# EAGLE design Nixiespeed2 (EAGLE 7.6.0)
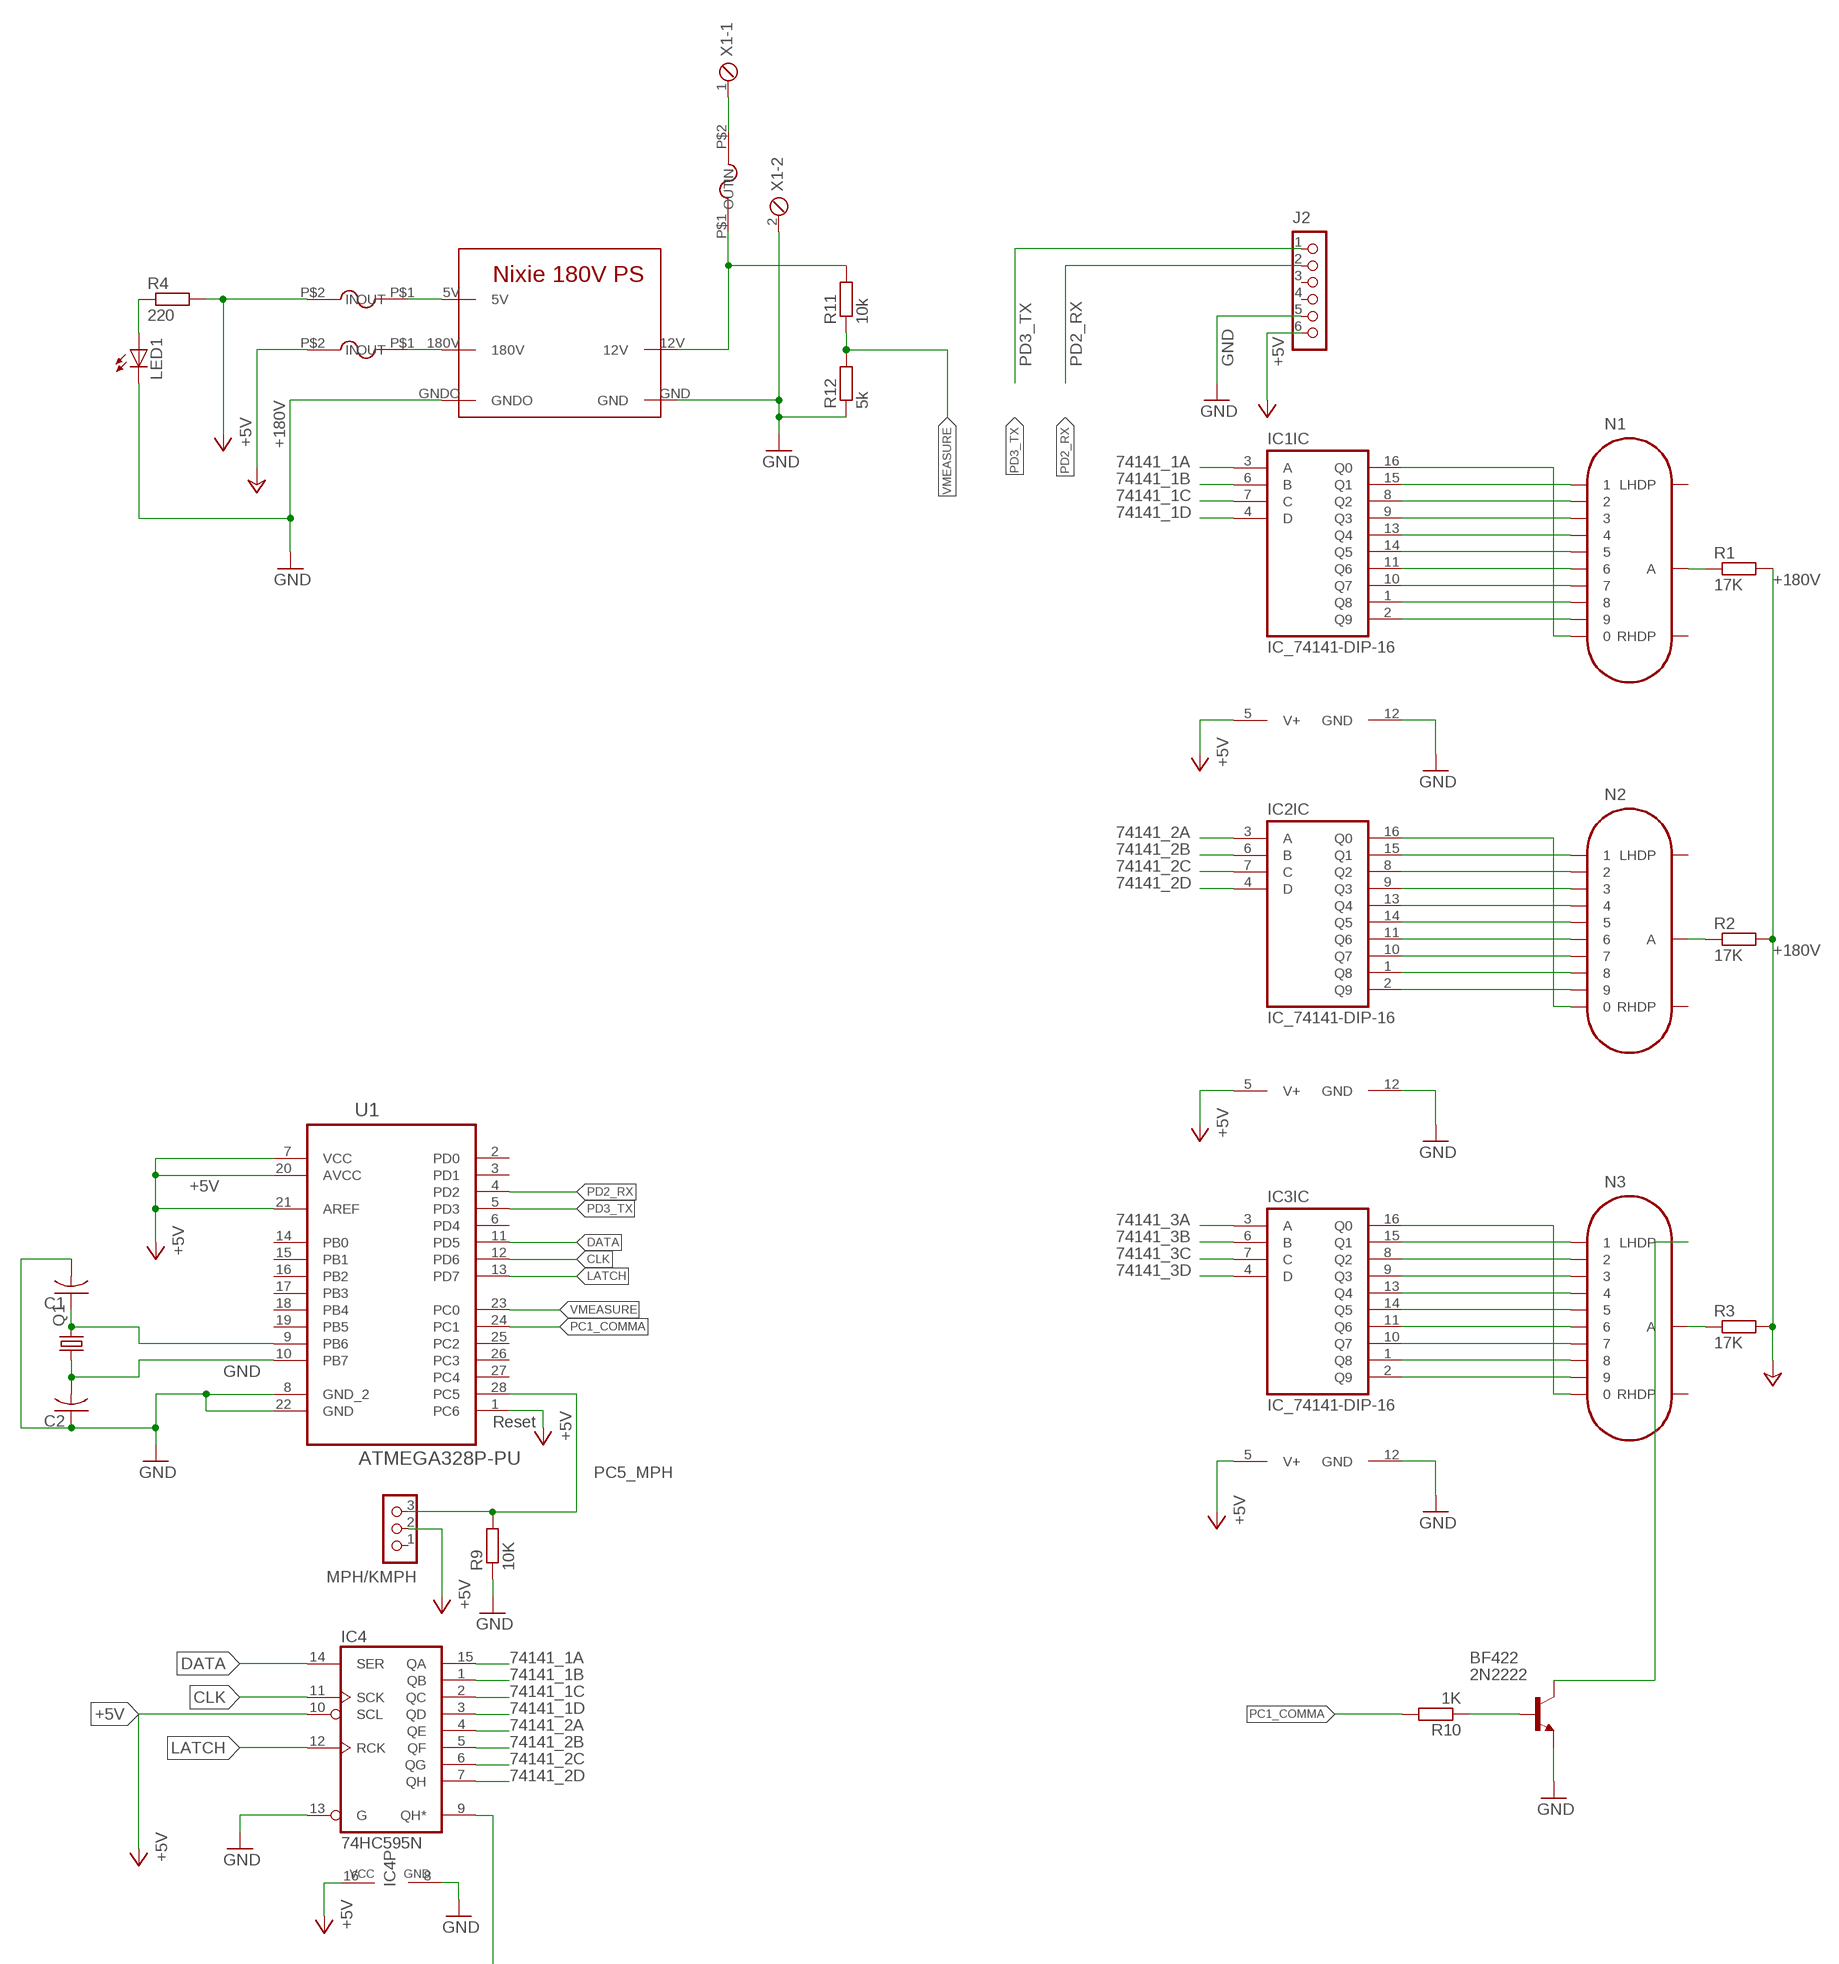
[diagram p0: schematic, sheet 1, part 1 of 2]
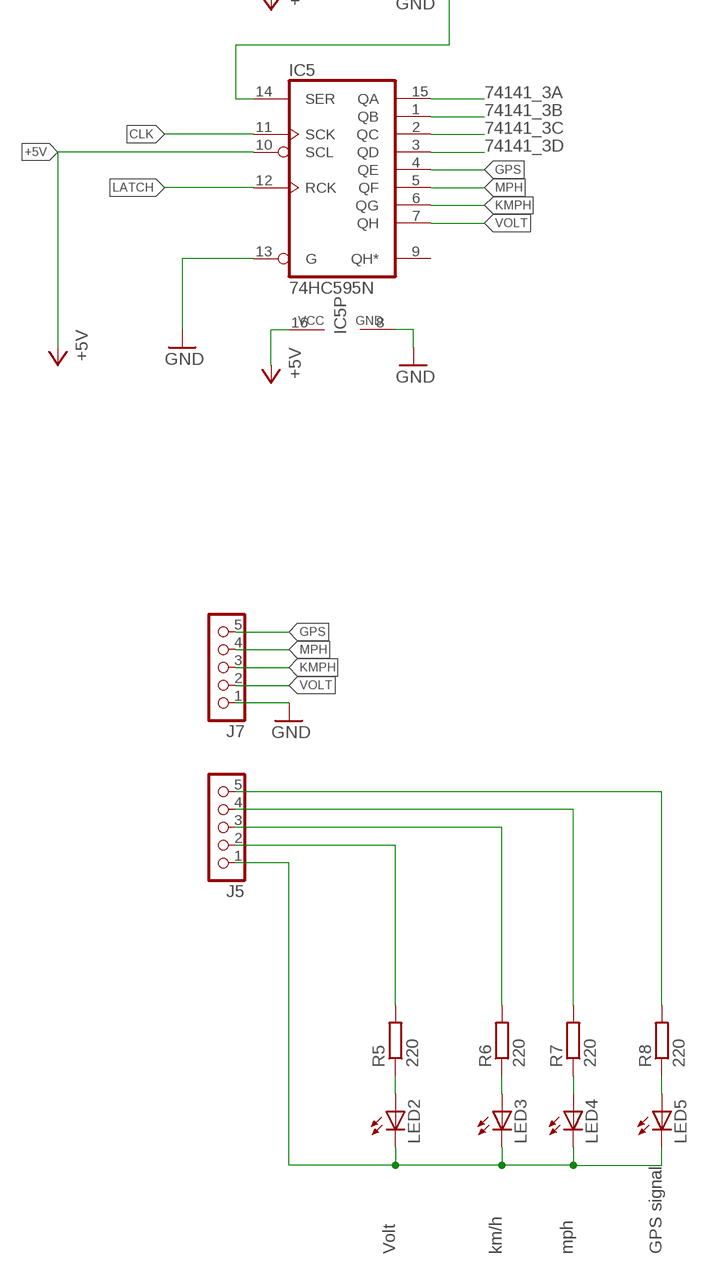
[diagram p1: schematic, sheet 1, part 2 of 2]

## Parts
BF422  2N2222  [TO92-EBC-OVAL]
C1  C-USC1206  [C1206]
C2  C-USC1206  [C1206]
F2  MICROFUSE  [MICROFUSE]
F3  MICROFUSE  [MICROFUSE]
IC1  IC_74141-DIP-16  [DIL16]
IC2  IC_74141-DIP-16  [DIL16]
IC3  IC_74141-DIP-16  [DIL16]
IC4  74HC595N  [DIL16]
IC5  74HC595N  [DIL16]
J2  CON_HEADER_1X06-PTH  [M1X6]
J5  CON_HEADER_1X05-PTH  [M1X5]
J7  CON_HEADER_1X05-PTH  [M1X5]
LED1  LED3MM  [LED3MM]
LED2  LED3MM  [LED3MM]
LED3  LED3MM  [LED3MM]
LED4  LED3MM  [LED3MM]
LED5  LED3MM  [LED3MM]
MPH/KMPH  CON_HEADER_1X03-PTH  [M1X3]
N1  IN-14  [IN-14]
N2  IN-14  [IN-14]
N3  IN-14  [IN-14]
Q1  CRYSTALHC49S  [HC49/S]
R1  17K  R-EU_0204/7  [0204/7]
R2  17K  R-EU_0204/7  [0204/7]
R3  17K  R-EU_0204/7  [0204/7]
R4  220  R-EU_M1206  [M1206]
R5  220  R-EU_M1206  [M1206]
R6  220  R-EU_M1206  [M1206]
R7  220  R-EU_M1206  [M1206]
R8  220  R-EU_M1206  [M1206]
R9  10K  R-EU_M1206  [M1206]
R10  1K  R-EU_M1206  [M1206]
R11  10k  R-EU_M1206  [M1206]
R12  5k  R-EU_M1206  [M1206]
U1  ATMEGA328P-PU  [DIP254P762X457-28]
U$1  NIXIEPS  [NIXIEPS]
U$2  MICROFUSE  [MICROFUSE]
X1  MPT2  [2POL254]

## Nets
12V: R11.2 U$1.12V U$2.P$1(IN)
74141_1A: IC1.3(IC:A) IC4.15(QA)
74141_1B: IC1.6(IC:B) IC4.1(QB)
74141_1C: IC1.7(IC:C) IC4.2(QC)
74141_1D: IC1.4(IC:D) IC4.3(QD)
74141_2A: IC2.3(IC:A) IC4.4(QE)
74141_2B: IC2.6(IC:B) IC4.5(QF)
74141_2C: IC2.7(IC:C) IC4.6(QG)
74141_2D: IC2.4(IC:D) IC4.7(QH)
74141_3A: IC3.3(IC:A) IC5.15(QA)
74141_3B: IC3.6(IC:B) IC5.1(QB)
74141_3C: IC3.7(IC:C) IC5.2(QC)
74141_3D: IC3.4(IC:D) IC5.3(QD)
+5V: F2.P$2(OUT) IC1.5(SUPPLY:V+) IC2.5(SUPPLY:V+) IC3.5(SUPPLY:V+) IC4.10(SCL) IC4.16(VCC) IC5.10(SCL) IC5.16(VCC) J2.6 MPH/KMPH.2 R4.2 U1.1(PC6) U1.7(VCC) U1.20(AVCC) U1.21(AREF)
+180V: F3.P$2(OUT) R1.2 R2.2 R3.2 ; supply symbol labelled +24V
CLK: IC4.11(SCK) IC5.11(SCK) U1.12(PD6)
DATA: IC4.14(SER) U1.11(PD5)
GND: BF422.E C1.2 C2.1 IC1.12(SUPPLY:GND) IC2.12(SUPPLY:GND) IC3.12(SUPPLY:GND) IC4.8(GND) IC4.13(G) IC5.8(GND) IC5.13(G) J2.5 J7.1 LED1.K(C) R9.1 R12.1 U1.8(GND_2) U1.22(GND) U$1.GND U$1.GNDO X1.2
GPS: IC5.4(QE) J7.5
KMPH: IC5.6(QG) J7.3
LATCH: IC4.12(RCK) IC5.12(RCK) U1.13(PD7)
MPH: IC5.5(QF) J7.4
N$2: IC2.15(IC:Q1) N2.1
N$3: IC2.8(IC:Q2) N2.2
N$4: IC2.9(IC:Q3) N2.3
N$5: IC2.13(IC:Q4) N2.4
N$6: IC2.14(IC:Q5) N2.5
N$7: IC2.11(IC:Q6) N2.6
N$8: IC2.10(IC:Q7) N2.7
N$9: IC2.1(IC:Q8) N2.8
N$10: IC2.2(IC:Q9) N2.9
N$11: IC2.16(IC:Q0) N2.0
N$12: IC1.15(IC:Q1) N1.1
N$13: IC1.8(IC:Q2) N1.2
N$14: IC1.9(IC:Q3) N1.3
N$15: IC1.13(IC:Q4) N1.4
N$16: IC1.14(IC:Q5) N1.5
N$17: IC1.11(IC:Q6) N1.6
N$18: IC1.10(IC:Q7) N1.7
N$19: IC1.1(IC:Q8) N1.8
N$20: IC1.2(IC:Q9) N1.9
N$21: IC1.16(IC:Q0) N1.0
N$22: IC3.15(IC:Q1) N3.1
N$23: IC3.8(IC:Q2) N3.2
N$24: IC3.9(IC:Q3) N3.3
N$25: IC3.13(IC:Q4) N3.4
N$26: IC3.14(IC:Q5) N3.5
N$27: IC3.11(IC:Q6) N3.6
N$28: IC3.10(IC:Q7) N3.7
N$29: IC3.1(IC:Q8) N3.8
N$30: IC3.2(IC:Q9) N3.9
N$31: IC3.16(IC:Q0) N3.0
N$32: N3.A R3.1
N$33: N2.A R2.1
N$34: N1.A R1.1
N$35: LED1.A R4.1
N$36: IC4.9(QH*) IC5.14(SER)
N$37: F2.P$1(IN) U$1.5V
N$38: BF422.B R10.1
N$39: BF422.C N3.LHDP
N$40: LED2.A R5.1
N$41: J5.2 R5.2
N$42: J5.3 R6.2
N$43: J5.4 R7.2
N$44: LED4.A R7.1
N$45: LED3.A R6.1
N$46: LED5.A R8.1
N$48: J5.5 R8.2
N$49: J5.1 LED2.K(C) LED3.K(C) LED4.K(C) LED5.K(C)
N$50: U$2.P$2(OUT) X1.1
N$51: C2.2 Q1.1 U1.10(PB7)
N$52: C1.1 Q1.2 U1.9(PB6)
N$53: F3.P$1(IN) U$1.180V
PC1_COMMA: R10.2 U1.24(PC1)
PC5_MPH: MPH/KMPH.3 R9.2 U1.28(PC5)
PD2_RX: J2.2 U1.4(PD2)
PD3_TX: J2.1 U1.5(PD3)
VMEASURE: R11.1 R12.2 U1.23(PC0)
VOLT: IC5.7(QH) J7.2
Unconnected: IC5.9(QH*) J2.3 J2.4 MPH/KMPH.1 N1.LHDP N1.RHDP N2.LHDP N2.RHDP N3.RHDP U1.2(PD0) U1.3(PD1) U1.6(PD4) U1.14(PB0) U1.15(PB1) U1.16(PB2) U1.17(PB3) U1.18(PB4) U1.19(PB5) U1.25(PC2) U1.26(PC3) U1.27(PC4)

## Notes on the sheet
- Reset
- Volt | km/h | mph | GPS signal

## Library data of the parts
BF422 = adafruit:2N2222: NPN TRANSISTOR Big oval pads
C1 C2 = adafruit:C-US: CAPACITOR, American symbol
F2 F3 U$2 = Nixie:MICROFUSE
IC1-IC3 = dp_devices.v6:IC_74141: BCD to decimal decoder
IC4 IC5 = 74xx-eu:74*595: 8-bit SHIFT REGISTER, output latch
J2 = dp_devices.v6:CON_HEADER_1X06
J5 J7 = dp_devices.v6:CON_HEADER_1X05
LED1-LED5 = led:LED: LED OSRAM: - CHIPLED LG R971, LG N971, LY N971, LG Q971, LY Q971, LO R971, LY R971 LH N974, LH R974 LS Q976, LO Q976, LY Q976 LO Q996 - Hyper CHIPLED LW Q18S LB Q993, LB Q99A, LB R99A - SideLED LS A670, LO A670, LY A670, LG A670, LP A670 LB A673, LV A673, LT A673, LW A673 LH A674 LY A675 LS A676, LA A676, LO A676, LY A676, LW A676 LS A679, LY A679, LG A679 - Hyper Micro SIDELED® LS Y876, LA Y876, LO Y876, LY Y876 LT Y87S - SmartLED LW L88C, LW L88S LB L89C, LB L89S, LG L890 LS L89K, LO L89K, LY L89K LS L896, LA L896, LO L896, LY L896 - TOPLED LS T670, LO T670, LY T670, LG T670, LP T670 LSG T670, LSP T670, LSY T670, LOP T670, LYG T670 LG T671, LOG T671, LSG T671 LB T673, LV T673, LT T673, LW T673 LH T674 LS T676, LA T676, LO T676, LY T676, LB T676, LH T676, LSB T676, LW T676 LB T67C, LV T67C, LT T67C, LS T67K, LO T67K, LY T67K, LW E67C LS E67B, LA E67B, LO E67B, LY E67B, LB E67C, LV E67C, LT E67C LW T67C LS T679, LY T679, LG T679 LS T770, LO T770, LY T770, LG T770, LP T770 LB T773, LV T773, LT T773, LW T773 LH T774 LS E675, LA E675, LY E675, LS T675 LS T776, LA T776, LO T776, LY T776, LB T776 LHGB T686 LT T68C, LB T68C - Hyper Mini TOPLED® LB M676 - Mini TOPLED Santana® LG M470 LS M47K, LO M47K, LY M47K Source: http://www.osram.convergy.de LUXEON: - LUMILED® LXK2-PW12-R00, LXK2-PW12-S00, LXK2-PW14-U00, LXK2-PW14-V00 LXK2-PM12-R00, LXK2-PM12-S00, LXK2-PM14-U00 LXK2-PE12-Q00, LXK2-PE12-R00, LXK2-PE12-S00, LXK2-PE14-T00, LXK2-PE14-U00 LXK2-PB12-K00, LXK2-PB12-L00, LXK2-PB12-M00, LXK2-PB14-N00, LXK2-PB14-P00, LXK2-PB14-Q00 LXK2-PR12-L00, LXK2-PR12-M00, LXK2-PR14-Q00, LXK2-PR14-R00 LXK2-PD12-Q00, LXK2-PD12-R00, LXK2-PD12-S00 LXK2-PH12-R00, LXK2-PH12-S00 LXK2-PL12-P00, LXK2-PL12-Q00, LXK2-PL12-R00 Source: www.luxeon.com KINGBRIGHT: KA-3528ASYC Source: www.kingbright.com
MPH/KMPH = dp_devices.v6:CON_HEADER_1X03
N1-N3 = russian-nixies:IN-14: IN-14: medium numeric frontview nixie tube
Q1 = adafruit:CRYSTAL: CRYSTAL; OC_FARNELL: 1667008; OC_NEWARK: unknown
R1-R12 = resistor:R-EU_: RESISTOR, European symbol
U1 = Atmel_By_element14_Batch_1-00:ATMEGA328P-PU: 8-bit Microcontroller with In-System Programmable Flash; MPN: ATMEGA328P-PU; OC_FARNELL: 1715487; OC_NEWARK: 15R0268; PACKAGE: PDIP-28; SUPPLIER: Atmel
U$1 = Nixie:NIXIEPS
X1 = con-phoenix-254:MPT2: PHOENIX CONNECTOR; OC_FARNELL: unknown; OC_NEWARK: unknown

## Board
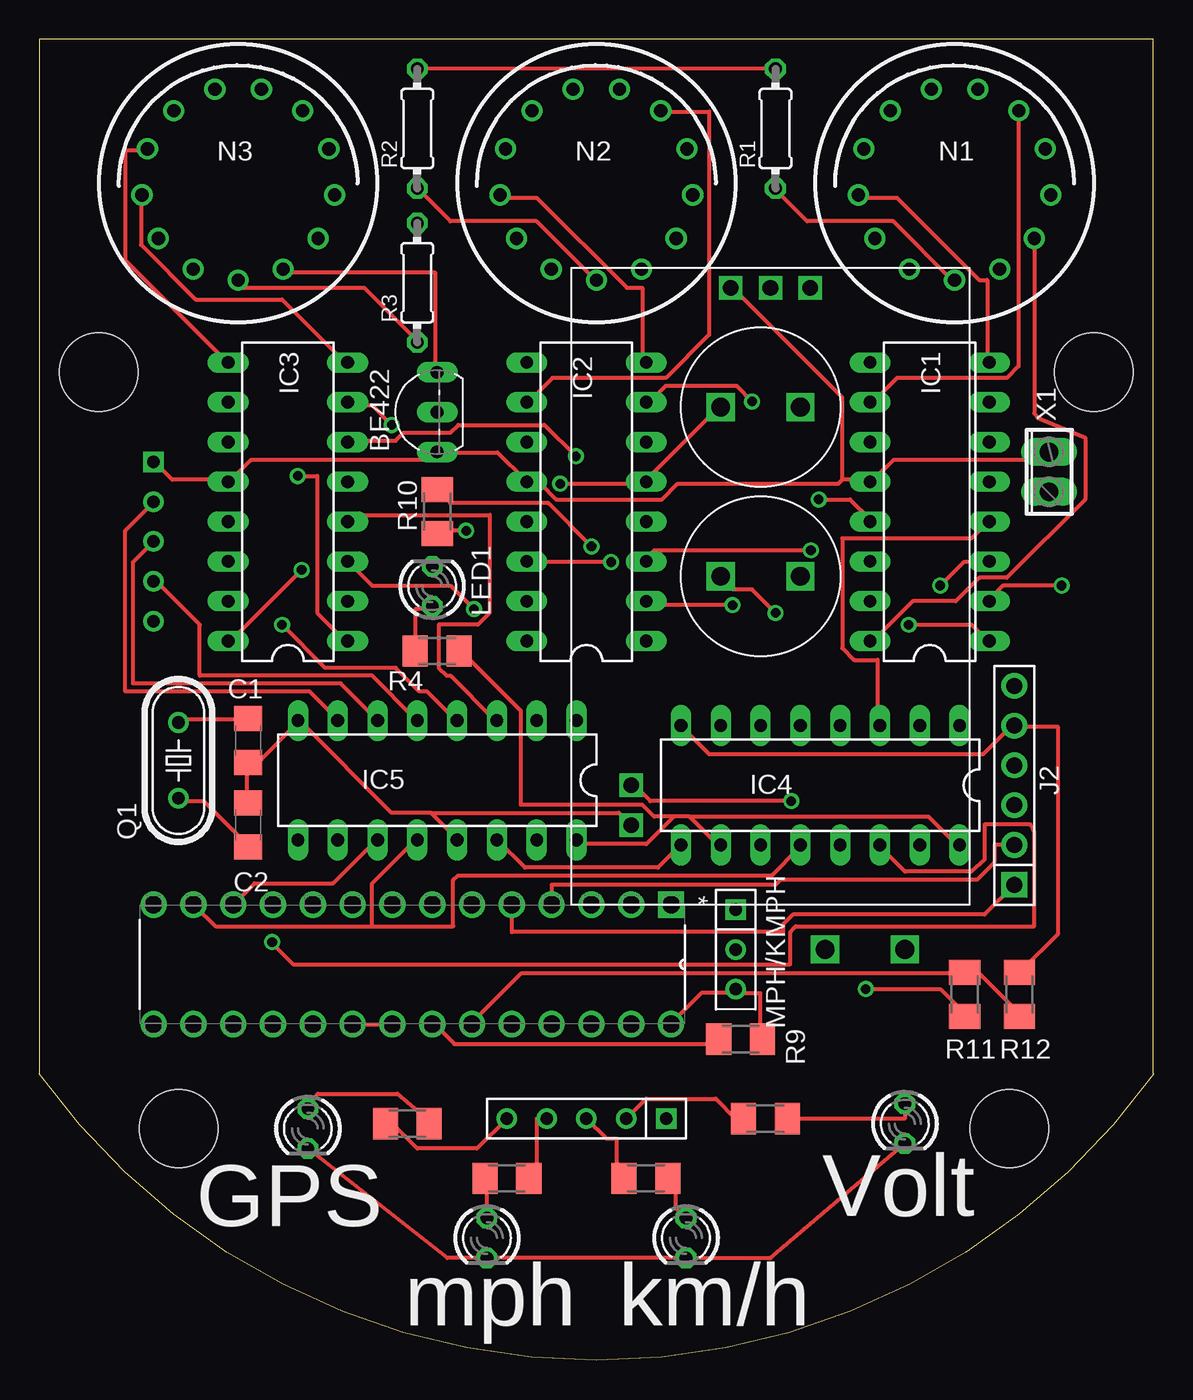
[diagram p2: board, top side]
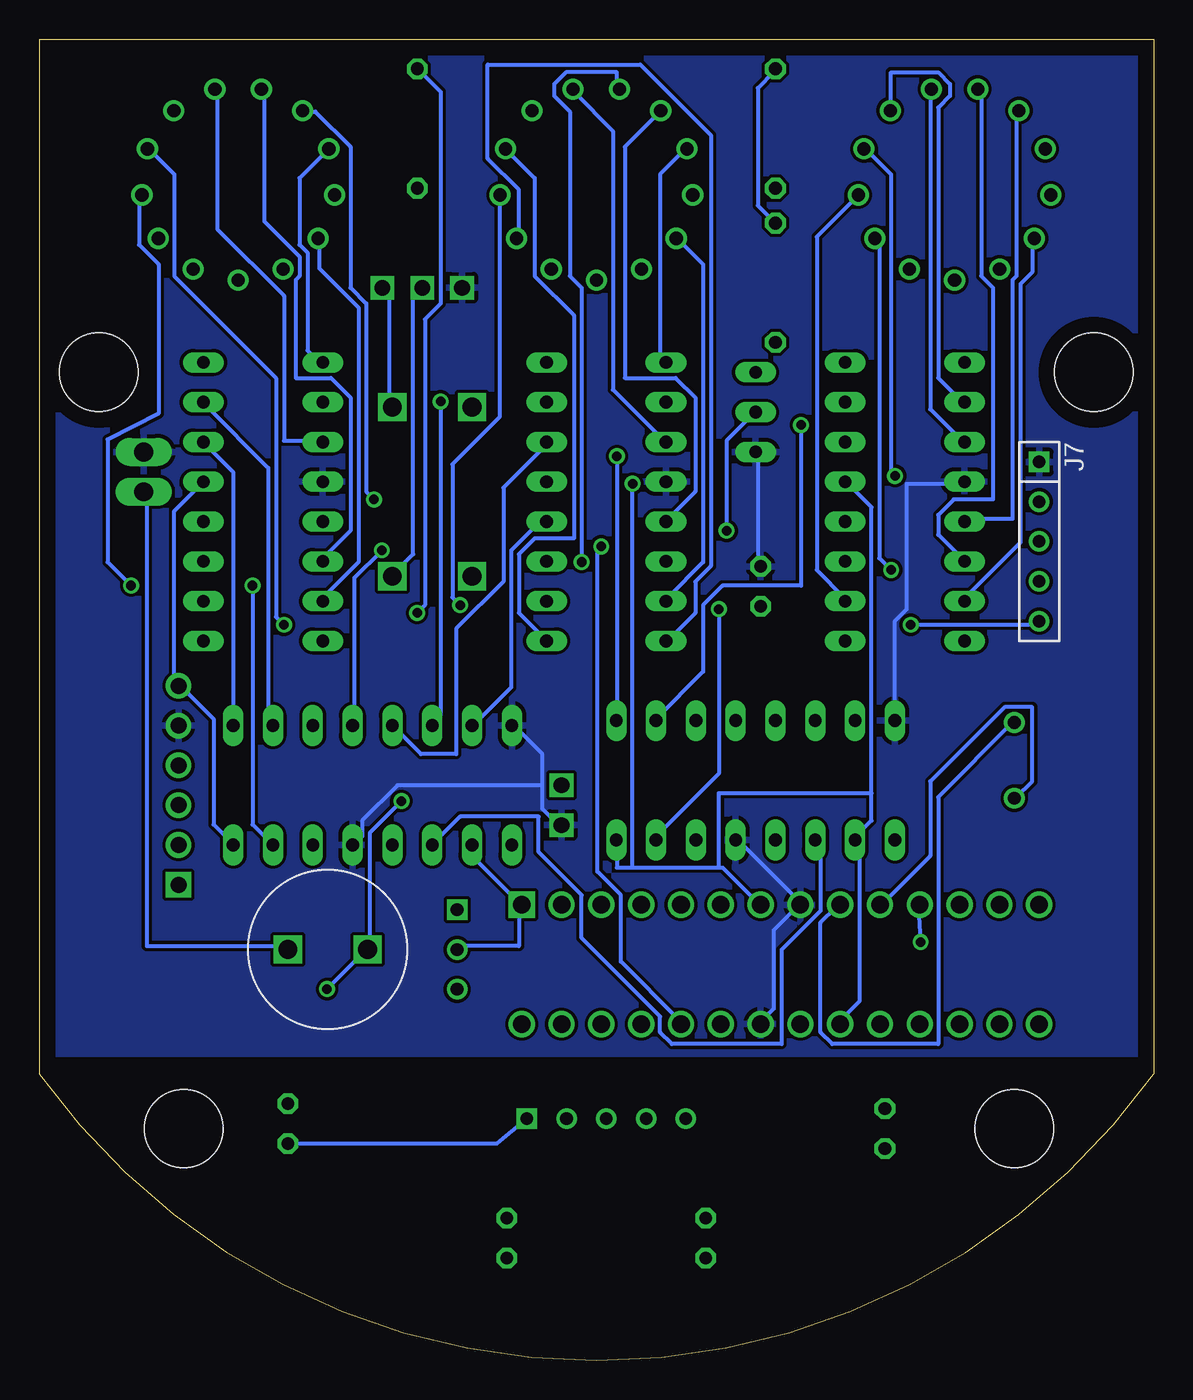
[diagram p3: board, bottom side, seen from below]

Size 71.12 x 84.31 mm. Coordinates in mm from the lower left corner, seen from the top.
Outline: 71.1,18.28 71.1,84.31 0,84.31 0,18.28 arc109 71.12,18.28
Copper layers (1*16): Top 0.035mm / dielectric 1.5mm / Bottom 0.035mm
Design rules "default *": minimum track width 10mil, minimum drill 24mil, track to track 8mil, track to pad 8mil, pad to pad 8mil, via to via 8mil, smd to smd 8mil, copper to edge 40mil, drill to drill 0.45mm, minimum pad ring 10mil, minimum via ring 8mil, stop-mask expansion 4mil, vias tented up to drill 0mil, thermal gap 10mil
Holes 5 mm at 3.81,63.05 67.31,63.05 8.89,14.79 61.91,14.79

### Footprints (pad centres in the part's own frame; a part is rotated, then mirrored left to right if it is on the bottom)
TO92-EBC-OVAL = drill 0.813 long: B 0,-1.27; C 2.54,-1.27; E -2.54,-1.27
C1206 = smd 1.6 x 1.8: 1 -1.4,0; 2 1.4,0
MICROFUSE = drill 1.2 square: P$1 -2.54,0; P$2 2.54,0
DIL16 = drill 0.813 long: 1 -8.89,-3.81; 2 -6.35,-3.81; 3 -3.81,-3.81; 4 -1.27,-3.81; 5 1.27,-3.81; 6 3.81,-3.81; 7 6.35,-3.81; 8 8.89,-3.81; 9 8.89,3.81; 10 6.35,3.81; 11 3.81,3.81; 12 1.27,3.81; 13 -1.27,3.81; 14 -3.81,3.81; 15 -6.35,3.81; 16 -8.89,3.81
M1X6 = drill 1.02 pad 1.632 square: 1 0,0 | drill 1.02 pad 1.632: 2 2.54,0; 3 5.08,0; 4 7.62,0; 5 10.16,0; 6 12.7,0
M1X5 = drill 0.8 square: 1 -5.08,0 | drill 0.8: 2 -2.54,0; 3 0,0; 4 2.54,0; 5 5.08,0
LED3MM = drill 0.813 octagon: A -1.27,0; K 1.27,0
M1X3 = drill 0.8 square: 1 0,0 | drill 0.8: 2 2.54,0; 3 5.08,0
IN-14 = drill 0.84: 0 5.094,-3.516; 1 -5.094,-3.516; 2 -6.145,-0.746; 3 -5.788,2.195; 4 -4.105,4.633; 5 -1.481,6.01; 6 1.481,6.01; 7 4.105,4.633; 8 5.788,2.195; 9 6.145,-0.746; A 0,-6.19; LHDP 2.877,-5.481; RHDP -2.877,-5.481
HC49/S = drill 0.813: 1 -2.413,0; 2 2.413,0
0204/7 = drill 0.813 octagon: 1 -3.81,0; 2 3.81,0
M1206 = smd 1.6 x 2: 1 -1.4,0; 2 1.4,0
DIP254P762X457-28 = drill 1.118 square: 1 -7.62,33.02 | drill 1.118: 2 -7.62,30.48; 3 -7.62,27.94; 4 -7.62,25.4; 5 -7.62,22.86; 6 -7.62,20.32; 7 -7.62,17.78; 8 -7.62,15.24; 9 -7.62,12.7; 10 -7.62,10.16; 11 -7.62,7.62; 12 -7.62,5.08; 13 -7.62,2.54; 14 -7.62,0; 15 0,0; 16 0,2.54; 17 0,5.08; 18 0,7.62; 19 0,10.16; 20 0,12.7; 21 0,15.24; 22 0,17.78; 23 0,20.32; 24 0,22.86; 25 0,25.4; 26 0,27.94; 27 0,30.48; 28 0,33.02
NIXIEPS = drill 1 square: 5V -5.08,2.54; 12V 26.67,-8.89; 180V -5.08,0; GND -5.08,-2.54; GNDO 29.21,-8.89
2POL254 = drill 1.2 long: 1 -1.27,0; 2 1.27,0

### Placement (x,y rotation side)
BF422  24.13,60.51 90 top
C1  13.34,39.55 270 top
C2  13.34,34.16 270 top
F2  46.04,60.83 180 top
F3  46.04,50.03 180 top
IC1  56.83,54.79 90 top
IC2  34.92,54.79 90 top
IC3  15.88,54.79 90 top
IC4  49.85,36.7 180 top
IC5  25.4,37.01 180 top
J2  62.23,30.35 90 top
J5  34.92,15.42 180 top
J7  7.3,52.25 270 bottom
LED1  25.08,49.4 90 top
LED2  55.24,15.11 270 top
LED3  41.27,7.8 270 top
LED4  28.57,7.8 270 top
LED5  17.14,14.79 270 top
MPH/KMPH  44.45,28.76 270 top
N1  58.42,75.11 0 top
N2  35.56,75.11 0 top
N3  12.7,75.11 0 top
Q1  8.89,38.28 90 top
R1  46.99,78.61 90 top
R2  24.13,78.61 90 top
R3  24.13,68.76 90 top
R4  25.4,45.27 0 top
R5  46.35,15.42 180 top
R6  38.73,11.61 180 top
R7  29.84,11.61 0 top
R8  23.5,15.11 180 top
R9  44.77,20.5 0 top
R10  25.4,54.16 90 top
R11  59.05,23.36 270 top
R12  62.55,23.36 270 top
U1  7.3,21.46 270 top
U$1  46.67,63.37 270 top
U$2  52.7,26.22 180 bottom
X1  64.45,56.7 90 top

### Tracks (layer width: path | path; a pad name or v marks a point on that pad's centre or on a via)
12V  (via drill 0.61)
  Top 0.254: v52.75,23.69 57.5,23.69 59,22.19 R11.2 | v48,35.69 39,35.69 38,36.69 U$1.12V
  Bottom 0.254: v52.75,23.69 50.25,26.19 U$2.P$1 50,26.44 50,33.69 v48,35.69
74141_1A  (via drill 0.61)
  Top 0.254: v57.5,49.44 59,50.94 60.5,50.94 IC1.3
  Bottom 0.254: v57.5,49.44 57.5,34.19 56.25,32.94 IC4.15
74141_1B
  Bottom 0.254: IC4.1 58.75,40.69 58.75,56.69 60.5,58.44 IC1.6
74141_1C
  Bottom 0.254: IC4.2 56.25,40.69 56.5,40.94 56.5,56.94 60.5,60.94 IC1.7
74141_1D
  Top 0.254: IC4.3 53.5,40.69 53.5,44.69 52,44.69 51.25,45.44 51.25,52.44 59.5,52.44 60.5,53.44 IC1.4
74141_2A  (via drill 0.61)
  Top 0.254: v49.25,51.69 39.25,51.69 38.75,51.19 IC2.3
  Bottom 0.254: v49.25,51.69 51,49.94 51,40.69 IC4.4
74141_2B
  Bottom 0.254: IC4.5 48.5,40.44 46.75,38.69 44.5,38.69 44.5,46.69 41.5,49.69 41.5,55.69 38.75,58.44 IC2.6
74141_2C  (via drill 0.61)
  Top 0.254: v45.5,61.19 44.5,62.19 40,62.19 39,61.19 IC2.7
  Bottom 0.254: v45.5,61.19 45.5,41.19 46,40.69 IC4.6
74141_2D
  Bottom 0.254: IC4.7 43.25,40.69 41,42.94 41,51.69 39.25,53.44 38.75,53.44 IC2.4
74141_3A  (via drill 0.61)
  Top 0.254: v27.75,47.94 26.25,49.44 21.25,49.44 19.75,50.94 IC3.3
  Bottom 0.254: v27.75,47.94 27.75,37.44 31.75,33.44 IC5.15
74141_3B  (via drill 0.61)
  Top 0.254: v34.25,57.69 32.25,59.69 26.75,59.69 26.25,59.19 23.25,59.19 22.75,58.69 19.75,58.69 IC3.6
  Bottom 0.254: v34.25,57.69 34.25,40.94 IC5.1
74141_3C  (via drill 0.61)
  Top 0.254: v22.5,59.69 21.25,60.94 19.75,60.94 IC3.7
  Bottom 0.254: v22.5,59.69 22.5,49.44 27.5,49.44 28.75,48.19 28.75,43.94 31.75,40.94 IC5.2
74141_3D
  Top 0.254: IC5.3 29,40.94 26.25,43.69 26,43.69 25.5,44.19 25.5,46.94 28,46.94 28.75,47.69 28.75,53.94 20,53.94 19.75,53.69 IC3.4
+5V  (via drill 0.61)
  Top 0.254: U1.21 22.5,21.44 20.25,21.44 U1.20 | F2.P$2 43.25,60.69 38.75,56.19 IC2.5 38.5,55.94 v33.25,55.94 | 41.5,34.69 40.5,34.69 | 40.5,34.69 39.25,34.69 38.5,35.44 30.75,35.44 30.75,41.44 27,45.19 R4.2 | 41.5,34.69 43.25,32.94 IC4.10 | 40.5,34.69 38.75,32.94 34.75,32.94 34.5,33.19 IC5.16 | 41.5,34.69 56.75,34.69 58.5,32.94 IC4.16
  Bottom 0.254: U1.20 20,21.69 18.75,22.94 18.75,32.94 19,33.19 IC5.10 19,33.44 18,34.44 18,36.19 | 18,36.19 18,54.44 19.5,55.94 IC3.5 | IC4.16 58.75,32.94 60,34.19 60,40.94 62,42.94 J2.6 62.25,43.19 62.5,43.44 62.5,54.19 60.75,55.94 IC1.5 | MPH/KMPH.2 44.25,26.44 40.5,26.44 40.5,28.94 U1.1 40.5,29.19 43.25,31.94 43.25,32.69 IC4.10 | 33.25,31.44 34.25,31.44 34.25,33.19 IC5.16 | 33.25,31.44 27.75,31.44 | 27.75,31.44 27.5,31.44 25.25,29.19 U1.7 | 33.25,31.44 v33.25,55.94 | 18,36.19 27.75,36.19 27.75,31.44
+180V  (via drill 0.61)
  Top 0.254: R1.2 46.75,82.44 24.25,82.44 R2.2 | v47,47.69 45.5,49.19 44.25,49.19 43.5,49.94 F3.P$2
  Bottom 0.254: R3.2 24.25,72.69 25.25,73.69 25.25,81.19 24.25,82.19 R2.2 | v47,47.69 46.5,48.19 46.5,66.44 45.5,67.44 45.5,80.94 46.75,82.19 R1.2
CLK
  Top 0.254: IC5.11 21.5,33.19 18.75,30.44 13.75,30.44 12.5,29.19 U1.12
  Bottom 0.254: IC4.11 46,32.94 44.25,34.69 39.25,34.69 39.25,32.44 36.5,29.69 36.5,26.94 31.5,21.94 31.5,20.94 30.75,20.19 23.75,20.19 23.75,26.19 21.25,28.69 21.25,32.94 21.5,33.19 IC5.11
DATA  (via drill 0.61)
  Top 0.254: v14.87,26.69 14.92,26.53 16.19,25.27 47.94,25.27 47.94,27.33 48.24,27.64 48.28,27.69 63.5,27.69 63.5,33.73 63.42,33.97 63.26,34.18 60.33,34.18 60.33,31.93 59.48,31.19 55.25,31.19 53.75,32.69 IC4.14
  Bottom 0.254: v14.87,26.69 15,28.94 U1.11
GND
  Top 0.254: R12.1 62.75,24.94 65,27.19 65,40.44 62.25,40.44 J2.5 62,40.44 60.25,38.69 42.75,38.69 41,40.44 IC4.8 | X1.2 64.25,57.94 63.75,57.44 54.5,57.44 53.25,56.19 IC1.12 53,56.19 51.25,56.19 | 51.25,56.19 51.25,61.44 44.25,68.44 U$1.GND | J7.1 7.5,57.19 8.5,56.19 12,56.19 IC3.12 12.25,56.19 13.5,57.44 24.75,57.44 25.25,57.94 BF422.E 25.5,57.94 29.25,57.94 31,56.19 IC2.12 31.25,55.94 32,55.94 33,54.94 39.75,54.94 40.75,55.94 51,55.94 51.25,56.19 | R9.1 43.25,20.44 43,20.19 26.5,20.19 25.25,21.44 U1.22 | C2.1 13.25,35.69 13.25,37.94 C1.2 13.5,38.19 14,38.19 16.5,40.69 IC5.8 16.75,40.69 22.5,34.94 25,34.94 | 25,34.94 26.5,33.44 IC5.13 | 25,34.94 37,34.94 37.75,34.19 U$1.GNDO
  Bottom 0.254: 39,36.69 39,35.19 38,34.19 U$1.GNDO | 39,36.69 39,38.69 40.75,40.44 IC4.8 | 39,36.69 48.25,36.69 50.5,34.44 50.5,33.44 51,32.94 IC4.13 | LED1.K 25.25,50.69 25.25,57.94 BF422.E | IC5.13 26.5,33.19 22.75,29.44 22.75,29.19 U1.8 22.75,28.94 24.25,27.44 24.25,22.44 25,21.69 U1.22 | IC3.12 12.25,55.94 15.75,55.94 15.75,47.94 16.5,47.19 16.5,40.94 IC5.8
  pour Bottom: 0.95,19.55 70.48,19.55 70.48,83.69 0.95,83.69
GPS  (via drill 0.61)
  Top 0.254: v15.5,46.94 18.25,44.19 22.75,44.19 24.25,42.69 24.75,42.69 26.5,40.94 IC5.4
  Bottom 0.254: v15.5,46.94 7.5,46.94 J7.5
KMPH
  Top 0.254: J7.3 7.25,52.19 6,50.94 6,43.19 19.25,43.19 21.5,40.94 IC5.6
LATCH
  Top 0.254: 21.25,27.69 21.25,30.44 24,33.19 IC5.12 | 21.25,27.69 11.25,27.69 10,28.94 U1.13 | 21.25,27.69 26.42,27.69 26.42,30.64 26.72,30.94 46.75,30.94 48.5,32.69 IC4.12
MPH
  Top 0.254: J7.4 7.5,49.69 10.25,46.94 10.25,43.69 21.25,43.69 24,40.94 IC5.5
N$2
  Bottom 0.254: IC2.15 31,48.69 28.75,50.94 28.75,69.94 30.25,71.44 N2.1
N$3
  Top 0.254: IC2.8 38.5,63.69 38.5,68.44 37.5,68.44 31.75,74.19 29.5,74.19 N2.2
N$4
  Bottom 0.254: IC2.9 31.25,63.69 31.5,63.94 31.5,75.69 30,77.19 N2.3
N$5
  Bottom 0.254: IC2.13 31,53.69 29.25,55.44 29.25,61.44 30.5,62.69 33.75,62.69 33.75,77.44 31.5,79.69 N2.4
N$6  (via drill 0.61)
  Top 0.254: v36.5,50.94 31.25,50.94 IC2.14
  Bottom 0.254: v36.5,50.94 36.5,68.44 37.25,69.19 37.25,79.69 38.25,80.69 38.25,81.44 37.5,82.19 34.25,82.19 34.25,81.19 N2.5
N$7
  Bottom 0.254: IC2.11 31.25,58.69 34.5,61.94 34.5,78.44 37,80.94 N2.6
N$8
  Top 0.254: IC2.10 31.25,61.19 32.75,62.69 40,62.69 42.75,65.44 42.75,79.69 39.75,79.69 N2.7
N$9
  Bottom 0.254: IC2.1 38.75,45.94 40.5,47.69 40.5,51.44 39.5,52.44 37,52.44 37,66.69 39.5,69.19 39.5,75.44 41.25,77.19 N2.8
N$10  (via drill 0.61)
  Top 0.254: v44.25,48.19 39,48.19 38.75,48.44 IC2.2
  Bottom 0.254: v44.25,48.19 44.75,48.69 44.75,57.19 41.75,60.19 41.75,74.19 N2.9
N$11
  Bottom 0.254: IC2.16 31,45.94 29.25,47.69 29.25,49.69 28.25,50.69 28.25,78.19 32.75,82.69 42.5,82.69 42.5,76.69 40.5,74.69 40.5,71.69 N2.0
N$12
  Bottom 0.254: IC1.15 53,48.69 50.75,50.94 50.75,67.19 53.25,69.69 53.25,71.44 N1.1
N$13
  Top 0.254: IC1.8 60.5,63.69 60.5,68.94 60,68.94 54.75,74.19 52.5,74.19 N1.2
N$14
  Bottom 0.254: IC1.9 53.25,63.69 54,64.44 54,70.69 54.5,71.19 54.5,75.44 52.75,77.19 N1.3
N$15  (via drill 0.61)
  Top 0.254: v49.75,54.94 51.75,54.94 53,53.69 IC1.13
  Bottom 0.254: v49.75,54.94 50.25,55.44 50.25,67.44 51.25,68.44 51.25,77.44 53.5,79.69 54.25,79.69 N1.4
N$16
  Bottom 0.254: IC1.14 53,51.19 51.25,52.94 51.25,61.44 52.5,62.69 54.75,62.69 54.75,68.94 54.5,69.19 54.5,70.44 56.75,72.69 56.75,80.94 N1.5
N$17
  Bottom 0.254: IC1.11 53.25,58.69 55.5,58.69 55.5,67.94 59.75,72.19 59.75,80.94 N1.6
N$18
  Top 0.254: IC1.10 53.25,61.19 54.75,62.69 61.75,62.69 62.5,63.44 62.5,79.69 N1.7
N$19  (via drill 0.61)
  Top 0.254: v55.5,46.94 59.5,46.94 60.5,45.94 IC1.1
  Bottom 0.254: v55.5,46.94 56,47.44 56,62.69 62.5,69.19 62.5,75.69 64,77.19 N1.8
N$20  (via drill 0.61)
  Top 0.254: v65.25,49.44 61.5,49.44 60.75,48.69 IC1.2
  Bottom 0.254: v65.25,49.44 66.75,50.94 66.75,58.76 63.5,60.42 63.5,69.94 64.75,71.19 64.75,74.19 N1.9
N$21
  Top 0.254: IC1.16 53.25,45.94 55.75,48.44 58.5,48.44 60,49.94 61.75,49.94 66.75,54.94 66.75,58.87 63.78,60.14 63.5,60.42 63.5,71.44 N1.0
N$22
  Bottom 0.254: IC3.15 12,48.69 8.5,52.19 8.5,68.69 7.75,69.44 7.75,71.44 N3.1
N$23
  Top 0.254: IC3.8 19.5,63.69 15.5,67.69 10,67.69 6.5,71.19 6.5,74.19 N3.2
N$24
  Top 0.254: IC3.9 12,63.69 5.5,70.19 5.5,77.19 6.75,77.19 N3.3
N$25
  Bottom 0.254: IC3.13 12,53.69 9,53.69 9,68.94 8.75,69.19 8.75,79.69 N3.4
N$26
  Bottom 0.254: IC3.14 12.25,51.19 13.75,52.69 13.75,53.94 12.75,54.94 10.25,54.94 10.25,68.44 11,69.19 11,80.94 N3.5
N$27
  Bottom 0.254: IC3.11 12.25,58.69 14.25,60.69 14.25,80.94 N3.6
N$28
  Bottom 0.254: IC3.10 12.25,61.19 13.75,62.69 13.75,79.94 13,80.69 13,81.44 13.75,82.19 16.75,82.19 16.75,79.94 N3.7
N$29  (via drill 0.61)
  Top 0.254: v16.5,56.44 17.75,56.44 17.75,47.69 19.5,45.94 IC3.1
  Bottom 0.254: v16.5,56.44 16.75,56.69 16.75,75.69 18.25,77.19 N3.8
N$30
  Bottom 0.254: IC3.2 19.75,48.69 21.5,50.44 21.5,71.69 19,74.19 N3.9
N$31  (via drill 0.61)
  Top 0.254: v16.75,50.44 12.25,45.94 IC3.16
  Bottom 0.254: v16.75,50.44 17.5,51.19 17.5,71.19 17.75,71.44 N3.0
N$32
  Top 0.254: R3.1 24,65.19 20.75,68.44 13,68.44 12.75,68.69 N3.A
N$33
  Top 0.254: R2.1 24.25,74.69 26.25,72.69 31.75,72.69 35.5,68.94 N2.A
N$34
  Top 0.254: R1.1 47,74.69 49,72.69 54.5,72.69 58.25,68.94 N1.A
N$35
  Top 0.254: R4.1 24,47.94 25,47.94 LED1.A
N$36
  Top 0.254: IC5.14 29.25,33.19 31,31.44 39.5,31.44 40.75,32.69 IC4.9
N$37
  Bottom 0.254: U$1.5V 49,68.44 48.75,68.19 48.75,60.94 F2.P$1
N$38  (via drill 0.61)
  Top 0.254: v27.25,52.94 25.5,52.94 R10.1
  Bottom 0.254: v27.25,52.94 27.25,58.69 25.5,60.44 BF422.B
N$39
  Top 0.254: BF422.C 25.25,63.19 25.25,69.44 15.75,69.44 N3.LHDP
N$40
  Top 0.254: R5.1 55.24,15.42 LED2.A
N$41
  Top 0.254: J5.2 38.73,16.69 43.18,16.69 44.45,15.42 R5.2
N$42
  Top 0.254: J5.3 36.2,14.15 36.83,14.15 36.83,11.61 R6.2
N$43
  Top 0.254: J5.4 31.75,15.42 31.75,11.61 R7.2
N$44
  Top 0.254: LED4.A 28.57,11.61 R7.1
N$45
  Top 0.254: LED3.A 40.64,9.71 40.64,11.61 R6.1
N$46
  Top 0.254: LED5.A 17.78,17.01 22.86,17.01 24.77,15.42 R8.1
N$48
  Top 0.254: J5.5 27.94,13.52 24.13,13.52 22.23,15.42 R8.2
N$49
  Top 0.254: LED5.K 26.04,6.53 LED4.K LED3.K 46.67,6.53 LED2.K
  Bottom 0.254: J5.1 41.91,13.84 LED2.K
N$50
  Bottom 0.254: U$2.P$2 55.25,26.44 64.25,26.44 64.25,55.19 X1.1
N$51
  Top 0.254: C2.2 13.25,32.94 10.5,35.69 9,35.69 Q1.1
  Bottom 0.254: U1.10 17.25,29.19 14.25,32.19 14.25,36.94 9.5,41.69 7.75,41.69 7.75,36.94 8.75,35.94 Q1.1
N$52
  Top 0.254: C1.1 13.25,40.94 9,40.94 Q1.2
  Bottom 0.254: U1.9 20.25,28.94 21.25,27.94 21.25,20.94 20.5,20.19 13.75,20.19 13.75,35.94 9,40.69 Q1.2
N$53
  Bottom 0.254: U$1.180V 46.75,68.44 47.25,67.94 47.25,51.44 48.5,50.19 F3.P$1
PC1_COMMA  (via drill 0.61)
  Top 0.254: v35.25,51.94 32.5,54.69 26.25,54.69 25.5,55.44 R10.2
  Bottom 0.254: v35.25,51.94 35.5,51.69 35.5,31.19 34,29.69 34,25.44 30.25,21.69 U1.24
PC5_MPH
  Top 0.254: R9.2 46,20.69 46,23.44 44.5,23.44 MPH/KMPH.3 44.25,23.44 42.25,23.44 40.5,21.69 U1.28
PD2_RX
  Top 0.254: J2.2 60.96,32.89 60.96,31.77 59.85,30.66 47.31,30.66 46.99,30.35 32.7,30.35 U1.4
PD3_TX
  Top 0.254: J2.1 60.33,28.44 48.1,28.44 47.47,27.81 47.47,27.33 30.16,27.33 U1.5
VMEASURE
  Top 0.254: R12.2 62.5,22.19 60,24.69 59.25,24.69 R11.1 59,24.69 30.75,24.69 27.75,21.69 U1.23
VOLT
  Top 0.254: J7.2 7.25,54.69 5.5,52.94 5.5,42.69 17.25,42.69 19,40.94 IC5.7

### Text on the board
tNames: Volt | GPS | mph | km/h